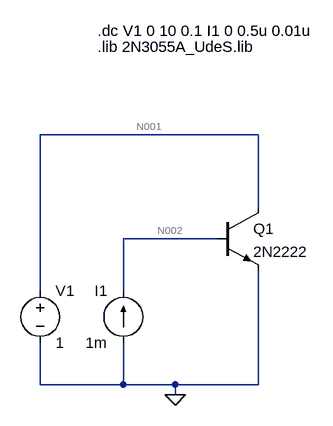
[diagram p0: schematic LaboE3.asc]
LaboE3.asc, the LTspice schematic file:
Version 4
SHEET 1 880 680
WIRE 240 -80 -96 -80
WIRE 240 32 240 -80
WIRE 176 80 32 80
WIRE -96 160 -96 -80
WIRE 32 160 32 80
WIRE -96 304 -96 240
WIRE 32 304 32 240
WIRE 32 304 -96 304
WIRE 112 304 32 304
WIRE 240 304 240 128
WIRE 240 304 112 304
WIRE 112 320 112 304
FLAG 112 320 0
SYMBOL voltage -96 144 R0
WINDOW 123 0 0 Left 0
WINDOW 39 0 0 Left 0
SYMATTR InstName V1
SYMATTR Value 1
SYMBOL npn 176 32 R0
SYMATTR InstName Q1
SYMATTR Value 2N2222
SYMBOL current 32 240 R180
WINDOW 0 24 80 Left 2
WINDOW 3 24 0 Left 2
WINDOW 123 0 0 Left 0
WINDOW 39 0 0 Left 0
SYMATTR InstName I1
SYMATTR Value 1m
TEXT -8 -240 Left 2 !.dc V1 0 10 0.1 I1 0 0.5u 0.01u
TEXT -8 -216 Left 2 !.lib 2N3055A_UdeS.lib

The netlist it stands for:
* LaboE3.asc
V1 N001 0 1
Q1 N001 N002 0 0 2N2222
I1 0 N002 1m
.model NPN NPN
.model PNP PNP
.lib standard.bjt
.dc V1 0 10 0.1 I1 0 0.5u 0.01u
.lib 2N3055A_UdeS.lib
.backanno
.end

* Results of the author's LTspice run, read from the files saved beside the schematic
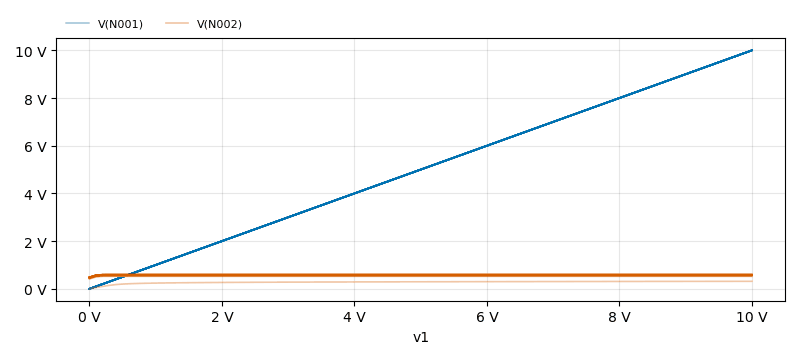
[diagram p1: DC transfer characteristic of LaboE3.asc, plotted from the saved traces]
* DC transfer characteristic, 51 runs:
*   V(N001) [run 1]: 0 V at v1=0 V, 10 V at v1=10 V, min 0 V, max 10 V
*   V(N001) [run 2]: 0 V at v1=0 V, 10 V at v1=10 V, min 0 V, max 10 V
*   V(N001) [run 3]: 0 V at v1=0 V, 10 V at v1=10 V, min 0 V, max 10 V
*   V(N001) [run 4]: 0 V at v1=0 V, 10 V at v1=10 V, min 0 V, max 10 V
*   V(N001) [run 5]: 0 V at v1=0 V, 10 V at v1=10 V, min 0 V, max 10 V
*   V(N001) [run 6]: 0 V at v1=0 V, 10 V at v1=10 V, min 0 V, max 10 V
*   V(N001) [run 7]: 0 V at v1=0 V, 10 V at v1=10 V, min 0 V, max 10 V
*   V(N001) [run 8]: 0 V at v1=0 V, 10 V at v1=10 V, min 0 V, max 10 V
*   V(N002) [run 1]: 0 V at v1=0 V, 314 mV at v1=10 V, min 0 V, max 314 mV
*   V(N002) [run 2]: 413.8 mV at v1=0 V, 522.8 mV at v1=10 V, min 413.8 mV, max 522.8 mV
*   V(N002) [run 3]: 431.7 mV at v1=0 V, 540.7 mV at v1=10 V, min 431.7 mV, max 540.7 mV
*   V(N002) [run 4]: 444.9 mV at v1=0 V, 553.9 mV at v1=10 V, min 444.9 mV, max 553.9 mV
*   V(N002) [run 5]: 451.7 mV at v1=0 V, 560.7 mV at v1=10 V, min 451.7 mV, max 560.7 mV
*   V(N002) [run 6]: 457.1 mV at v1=0 V, 566.1 mV at v1=10 V, min 457.1 mV, max 566.1 mV
*   V(N002) [run 7]: 462.9 mV at v1=0 V, 571.9 mV at v1=10 V, min 462.9 mV, max 571.9 mV
*   V(N002) [run 8]: 466.5 mV at v1=0 V, 575.5 mV at v1=10 V, min 466.5 mV, max 575.5 mV